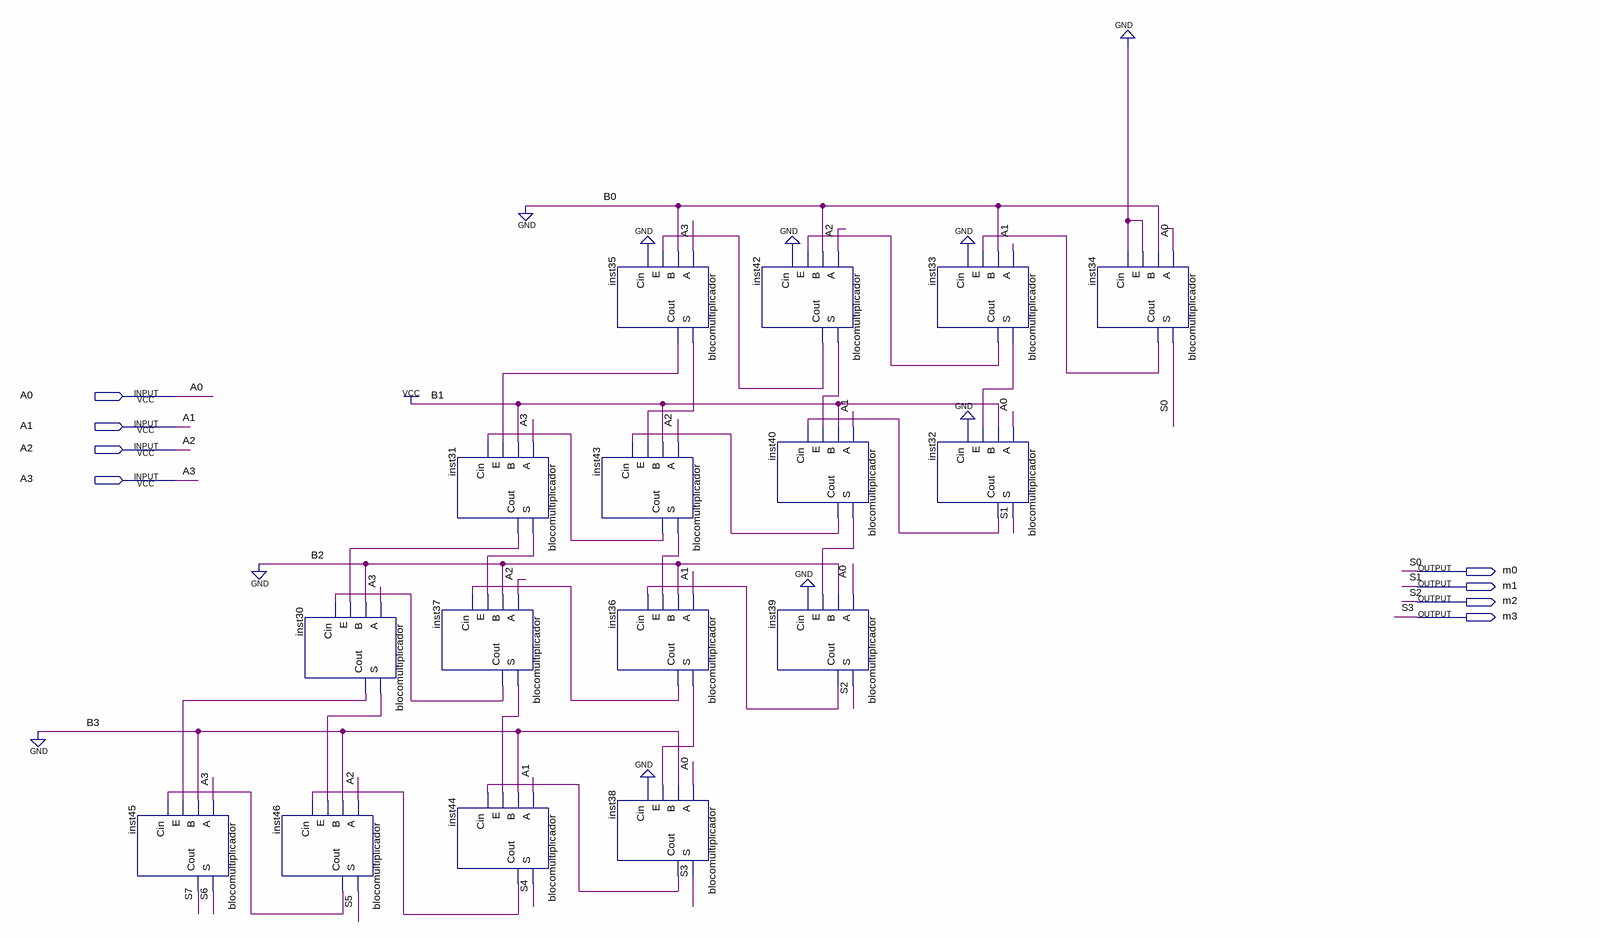
[diagram p0: schematic sheet]
// Quartus schematic multiplicador.bdf as structural Verilog: 16 symbols, 8 pins
module multiplicador (
  input  A0,
  input  A1,
  input  A2,
  input  A3,
  output m0,
  output m1,
  output m2,
  output m3
);

  wire inst30_cout, inst30_s, inst31_cout, inst31_s, inst32_cout, inst33_cout, inst33_s, inst34_cout,
       inst35_cout, inst35_s, inst36_cout, inst36_s, inst37_cout, inst37_s, inst38_cout, inst39_cout,
       inst40_cout, inst40_s, inst42_cout, inst42_s, inst43_cout, inst43_s, inst44_cout, inst46_cout, S4, S5,
       S6, S7;

  blocomultiplicador inst45 (.A(A3), .B(1'b0), .E(inst30_cout), .Cin(inst46_cout), .S(S6), .Cout(S7));
  blocomultiplicador inst46 (.A(A2), .B(1'b0), .E(inst30_s), .Cin(inst44_cout), .S(S5), .Cout(inst46_cout));
  blocomultiplicador inst30 (.A(A3), .B(1'b0), .E(inst31_cout), .Cin(inst37_cout), .S(inst30_s), .Cout(inst30_cout));
  blocomultiplicador inst31 (.A(A3), .B(1'b1), .E(inst35_cout), .Cin(inst43_cout), .S(inst31_s), .Cout(inst31_cout));
  blocomultiplicador inst37 (.A(A2), .B(1'b0), .E(inst31_s), .Cin(inst36_cout), .S(inst37_s), .Cout(inst37_cout));
  blocomultiplicador inst44 (.A(A1), .B(1'b0), .E(inst37_s), .Cin(inst38_cout), .S(S4), .Cout(inst44_cout));
  blocomultiplicador inst35 (.A(A3), .B(1'b0), .E(inst42_cout), .Cin(1'b0), .S(inst35_s), .Cout(inst35_cout));
  blocomultiplicador inst43 (.A(A2), .B(1'b1), .E(inst35_s), .Cin(inst40_cout), .S(inst43_s), .Cout(inst43_cout));
  blocomultiplicador inst36 (.A(A1), .B(1'b0), .E(inst43_s), .Cin(inst39_cout), .S(inst36_s), .Cout(inst36_cout));
  blocomultiplicador inst38 (.A(A0), .B(1'b0), .E(inst36_s), .Cin(1'b0), .S(m3), .Cout(inst38_cout));
  blocomultiplicador inst42 (.A(A2), .B(1'b0), .E(inst33_cout), .Cin(1'b0), .S(inst42_s), .Cout(inst42_cout));
  blocomultiplicador inst40 (.A(A1), .B(1'b1), .E(inst42_s), .Cin(inst32_cout), .S(inst40_s), .Cout(inst40_cout));
  blocomultiplicador inst39 (.A(A0), .B(1'b0), .E(inst40_s), .Cin(1'b0), .S(m2), .Cout(inst39_cout));
  blocomultiplicador inst33 (.A(A1), .B(1'b0), .E(inst34_cout), .Cin(1'b0), .S(inst33_s), .Cout(inst33_cout));
  blocomultiplicador inst32 (.A(A0), .B(1'b1), .E(inst33_s), .Cin(1'b0), .S(m1), .Cout(inst32_cout));
  blocomultiplicador inst34 (.A(A0), .B(1'b0), .E(1'b0), .Cin(1'b0), .S(m0), .Cout(inst34_cout));

  // Other names for the same wires on the sheet: S0 = m0; S1 = m1; S2 = m2; S3 = m3
endmodule
